# EAGLE schematic S140044_NOAA_TOWFISH (EAGLE 6.5.0)

## Sheet 1 of 5
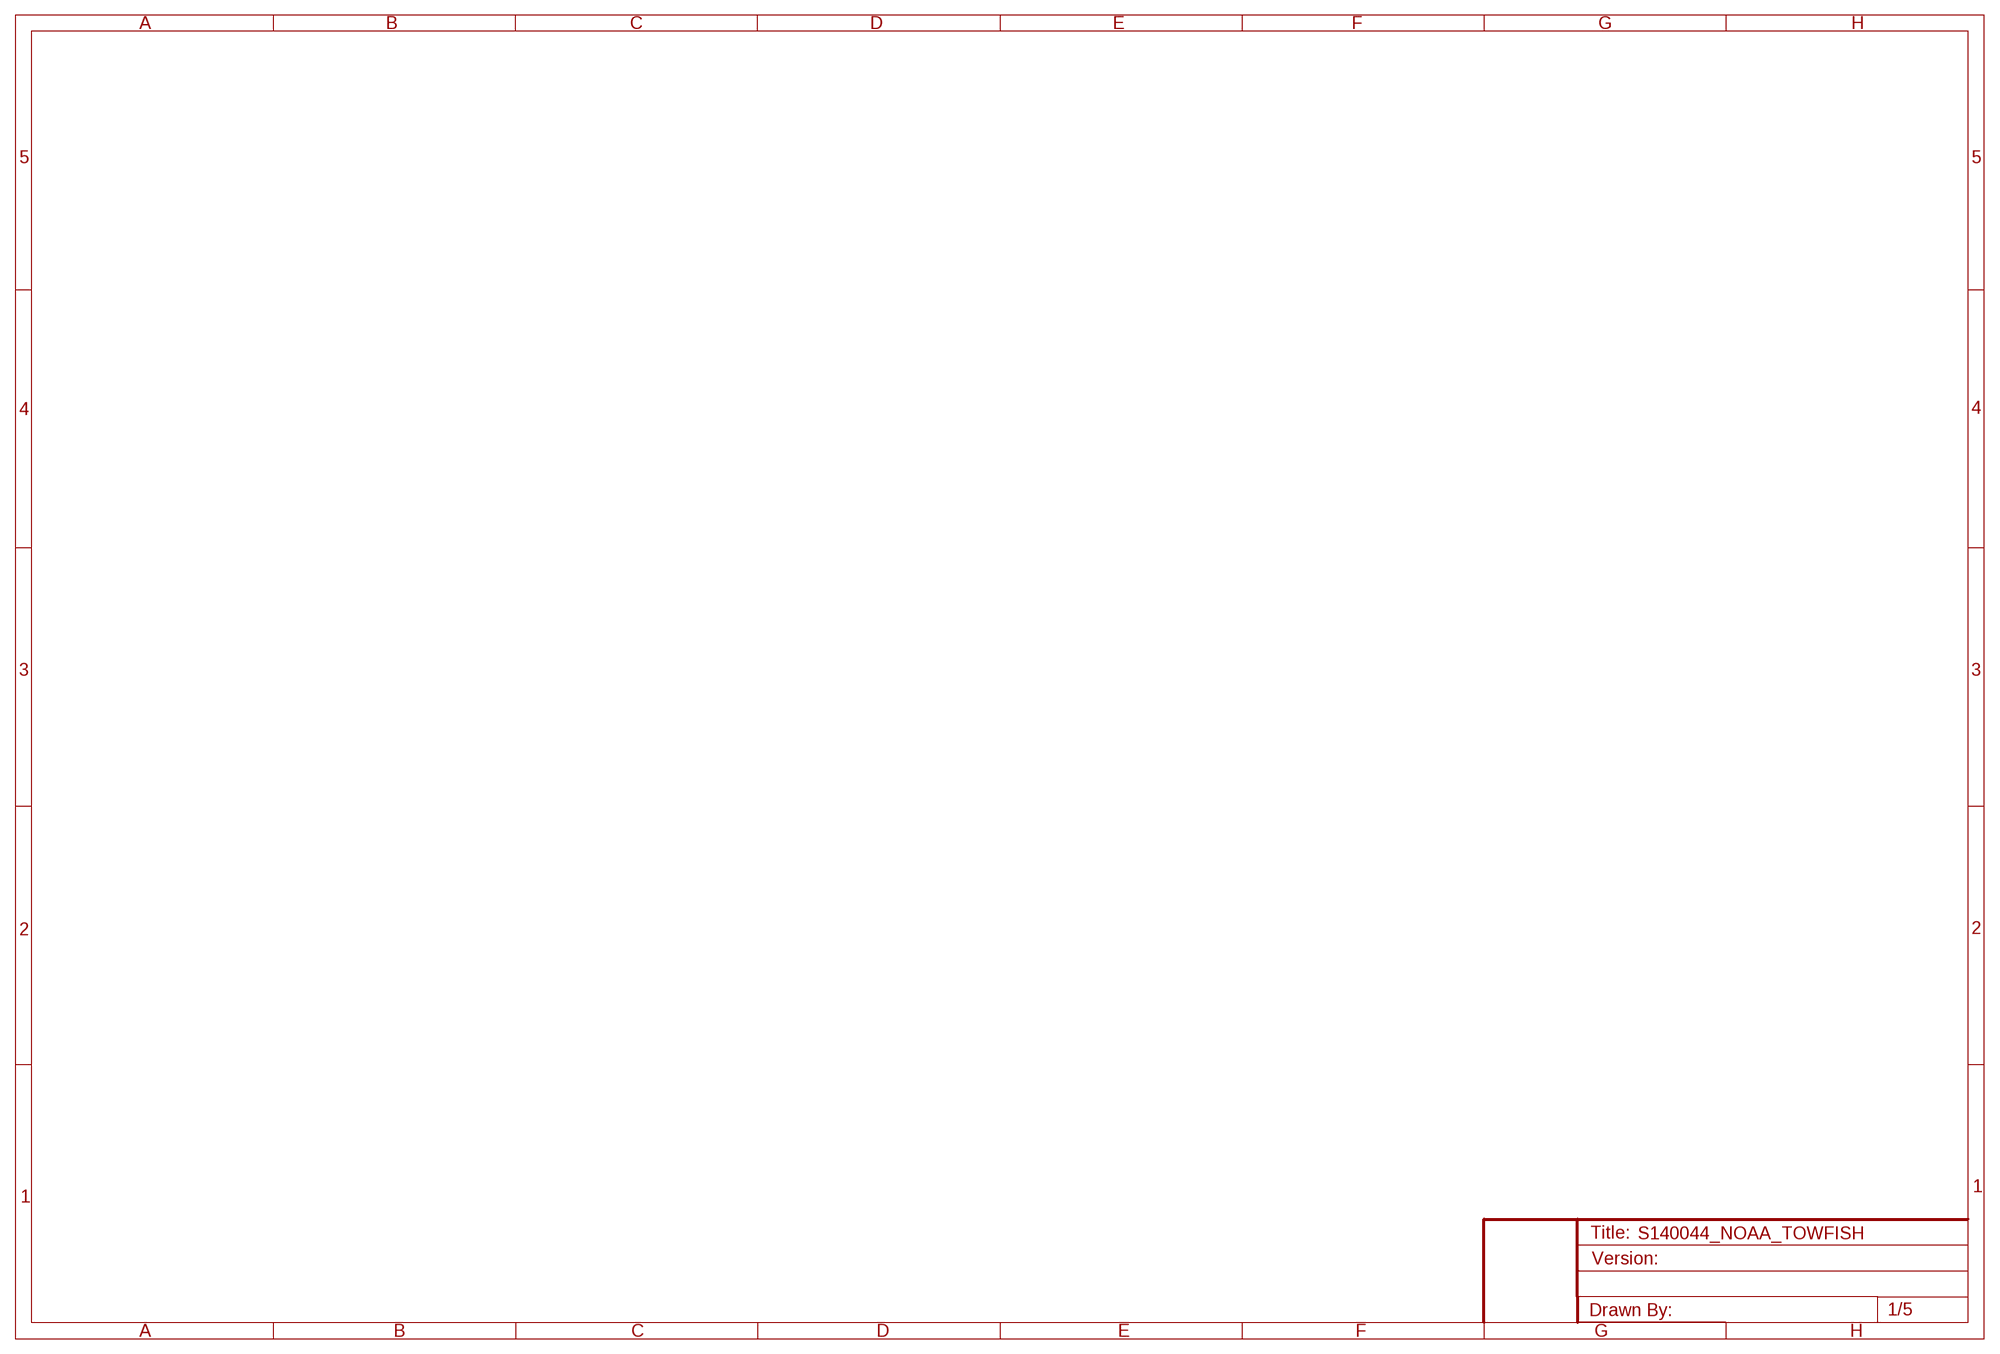
[diagram p0: schematic, sheet 1]

## Sheet 2 of 5
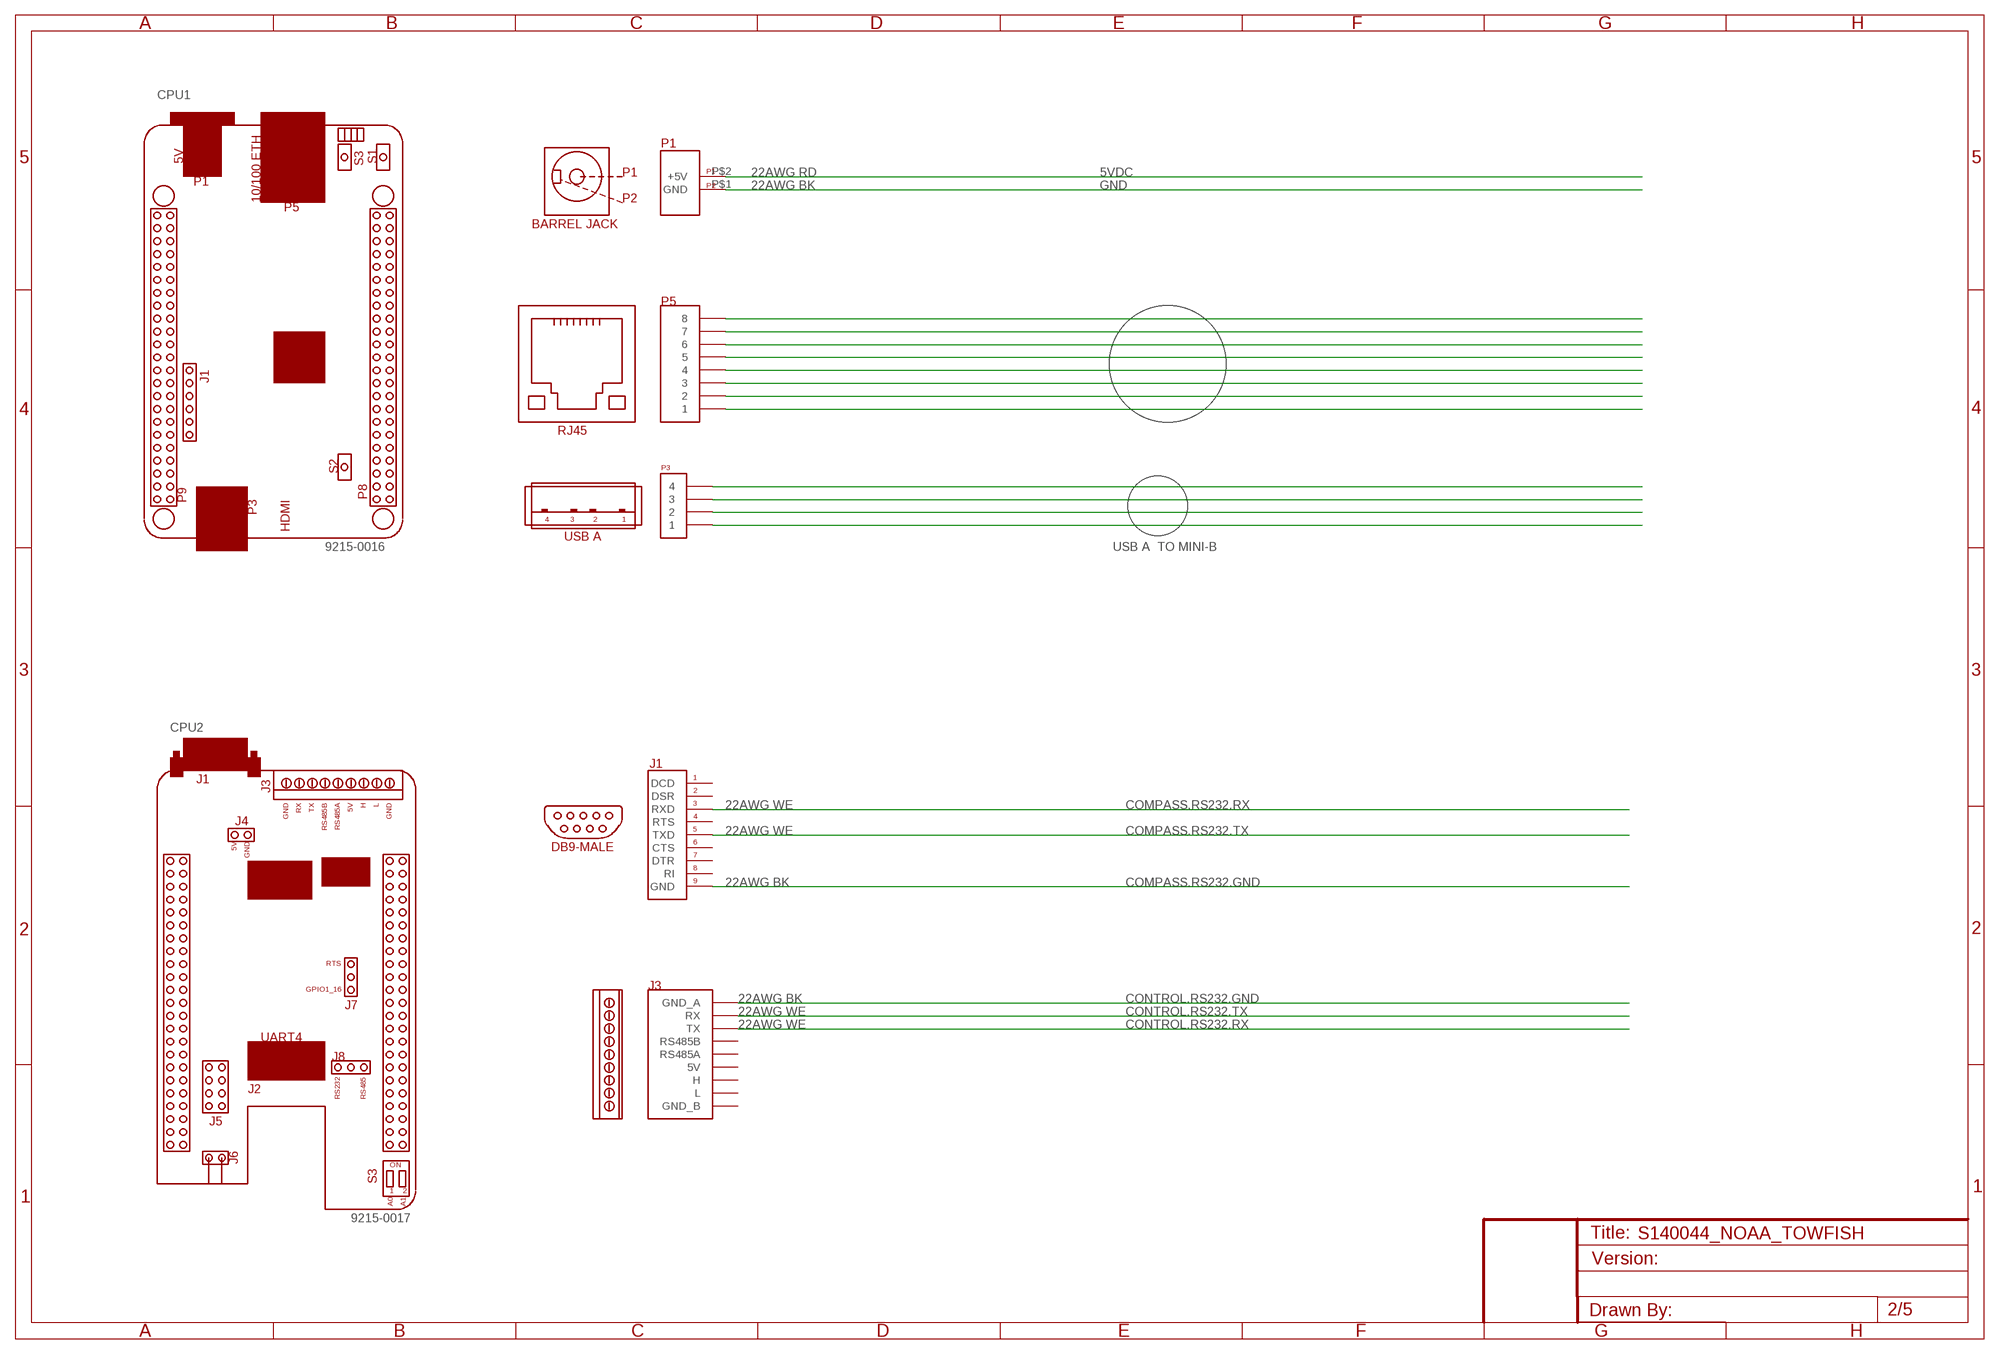
[diagram p1: schematic, sheet 2]

### Parts
U$3  BEAGLEBONE_BLACK_P1  [BOGUS]
U$4  BEAGLEBONE_BLACK_P3  [BOGUS]
U$5  BEAGLEBONE_SERIAL_J1  [BOGUS]
U$6  BEAGLEBONE_SERIAL_J3  [BOGUS]
U$7  BEAGLEBONE_BLACK_P5  [BOGUS]

### Nets
5VDC: U$3.P$2(+5V)
COMPASS.RS232.GND: U$5.P$5(GND) ; also sheet 4
COMPASS.RS232.RX: U$5.P$8(RXD) ; also sheet 4
COMPASS.RS232.TX: U$5.P$9(TXD) ; also sheet 4
CONTROL.RS232.GND: U$6.P$2(GND_A)
CONTROL.RS232.RX: U$6.P$9(TX)
CONTROL.RS232.TX: U$6.P$8(RX)
GND: U$3.P$1(GND)
N$3: U$7.P$8
N$4: U$7.P$7
N$5: U$7.P$6
N$6: U$7.P$5
N$7: U$7.P$4
N$8: U$7.P$3
N$9: U$7.P$2
N$10: U$7.P$1
N$11: U$4.P$4
N$12: U$4.P$3
N$13: U$4.P$2
N$14: U$4.P$1
Unconnected: U$5.P$1(CTS) U$5.P$2(DCD) U$5.P$3(DSR) U$5.P$4(DTR) U$5.P$6(RI) U$5.P$7(RTS) U$6.P$1(5V) U$6.P$3(GND_B) U$6.P$4(H) U$6.P$5(L) U$6.P$6(RS485A) U$6.P$7(RS485B)

### Notes on the sheet
- CPU1
- 22AWG RD
- 22AWG BK
- 9215-0016 | USB A  TO MINI-B
- CPU2
- 22AWG WE
- 22AWG WE
- 22AWG BK
- 22AWG BK
- 22AWG WE
- 22AWG WE
- 9215-0017

## Sheet 3 of 5
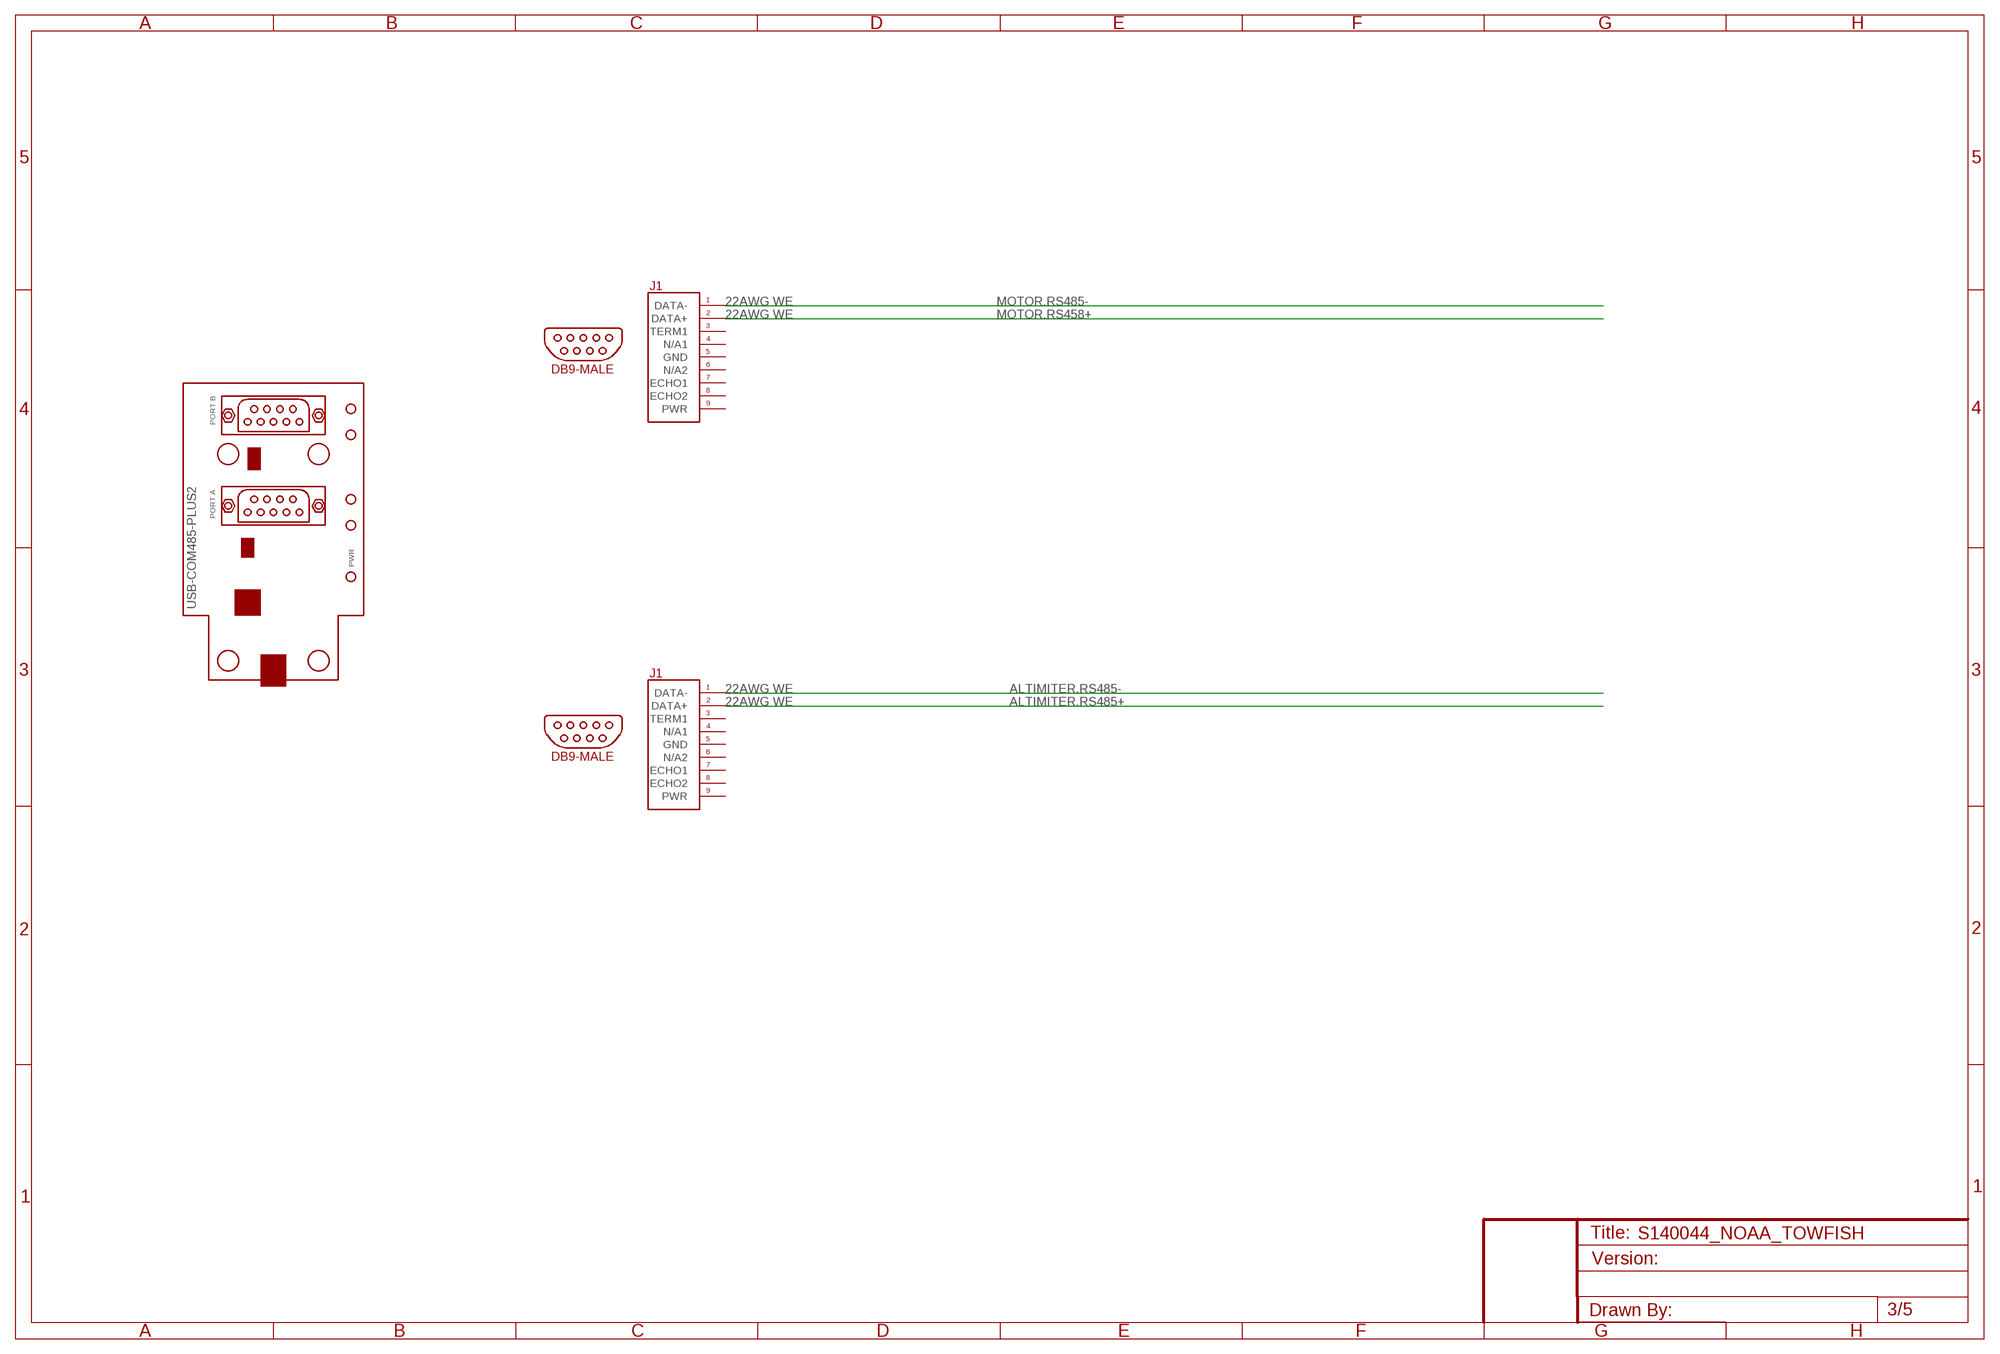
[diagram p2: schematic, sheet 3]

### Parts
U$10  FTDI_USB_RS485_COM2  [BOGUS]
U$11  FTDI_PORTB  [BOGUS]
U$12  FTDI_PORTA  [BOGUS]

### Nets
ALTIMITER.RS485+: U$12.P$1(DATA+)
ALTIMITER.RS485-: U$12.P$2(DATA-)
MOTOR.RS458+: U$11.P$1(DATA+)
MOTOR.RS485-: U$11.P$2(DATA-)
Unconnected: U$11.P$3(ECHO1) U$11.P$4(ECHO2) U$11.P$5(GND) U$11.P$6(N/A1) U$11.P$7(N/A2) U$11.P$8(PWR) U$11.P$9(TERM1) U$12.P$3(ECHO1) U$12.P$4(ECHO2) U$12.P$5(GND) U$12.P$6(N/A1) U$12.P$7(N/A2) U$12.P$8(PWR) U$12.P$9(TERM1)

### Notes on the sheet
- 22AWG WE
- 22AWG WE
- 22AWG WE
- 22AWG WE

## Sheet 4 of 5
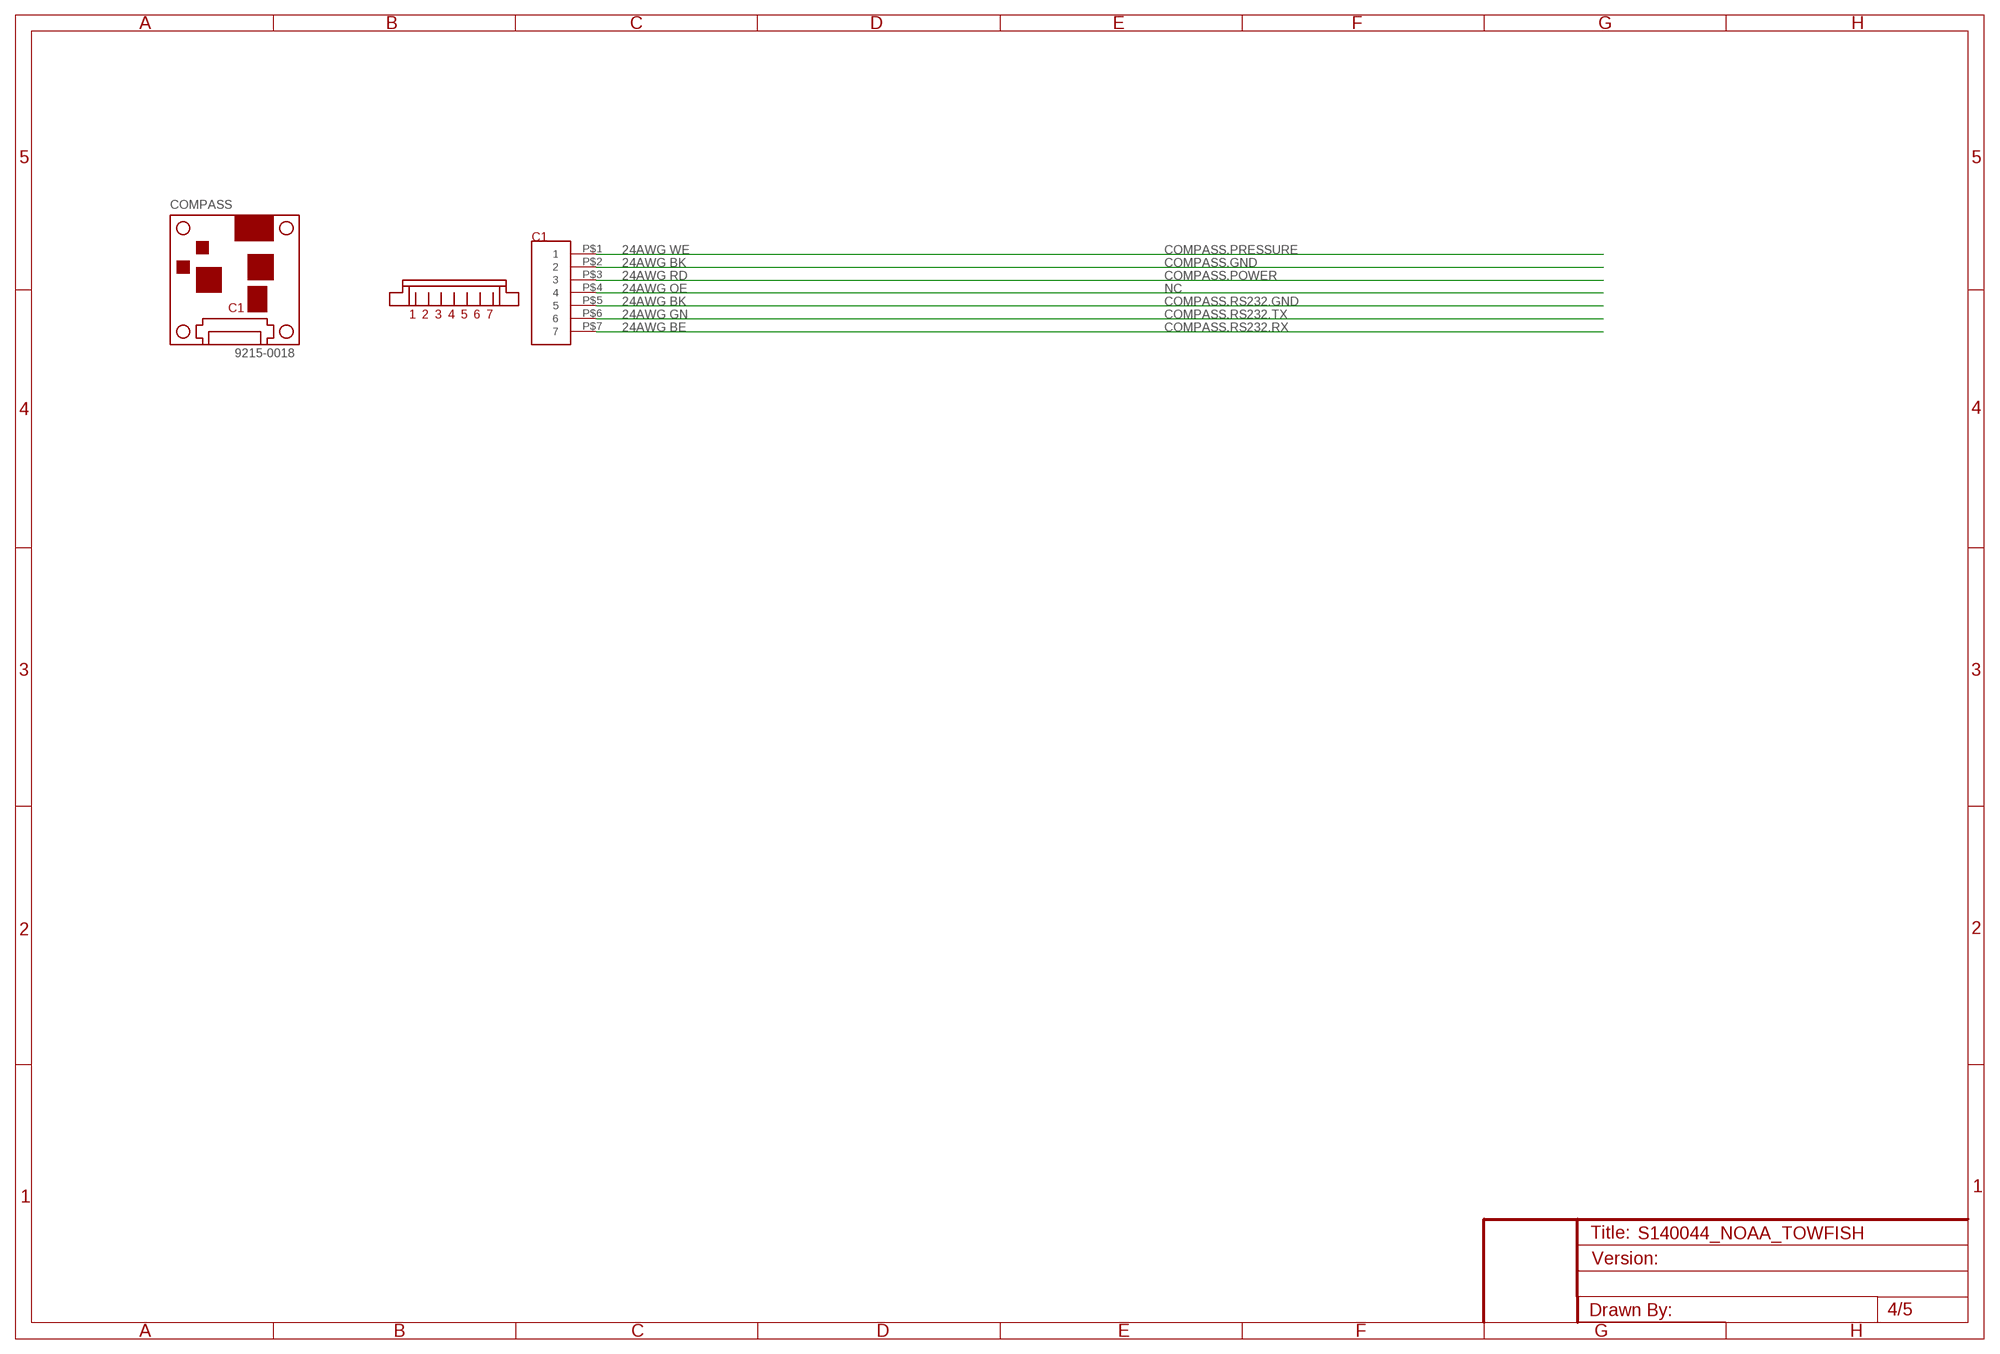
[diagram p3: schematic, sheet 4]

### Parts
U$8  OCEANSERVER_OS5000-S_C1  [BOGUS]

### Nets
COMPASS.GND: U$8.P$2
COMPASS.POWER: U$8.P$3
COMPASS.PRESSURE: U$8.P$1
COMPASS.RS232.GND: U$8.P$5 ; also sheet 2
COMPASS.RS232.RX: U$8.P$7 ; also sheet 2
COMPASS.RS232.TX: U$8.P$6 ; also sheet 2
NC: U$8.P$4

### Notes on the sheet
- COMPASS
- 24AWG WE
- 24AWG BK
- 24AWG RD
- 24AWG OE
- 24AWG BK
- 24AWG GN
- 24AWG BE
- 9215-0018

## Sheet 5 of 5
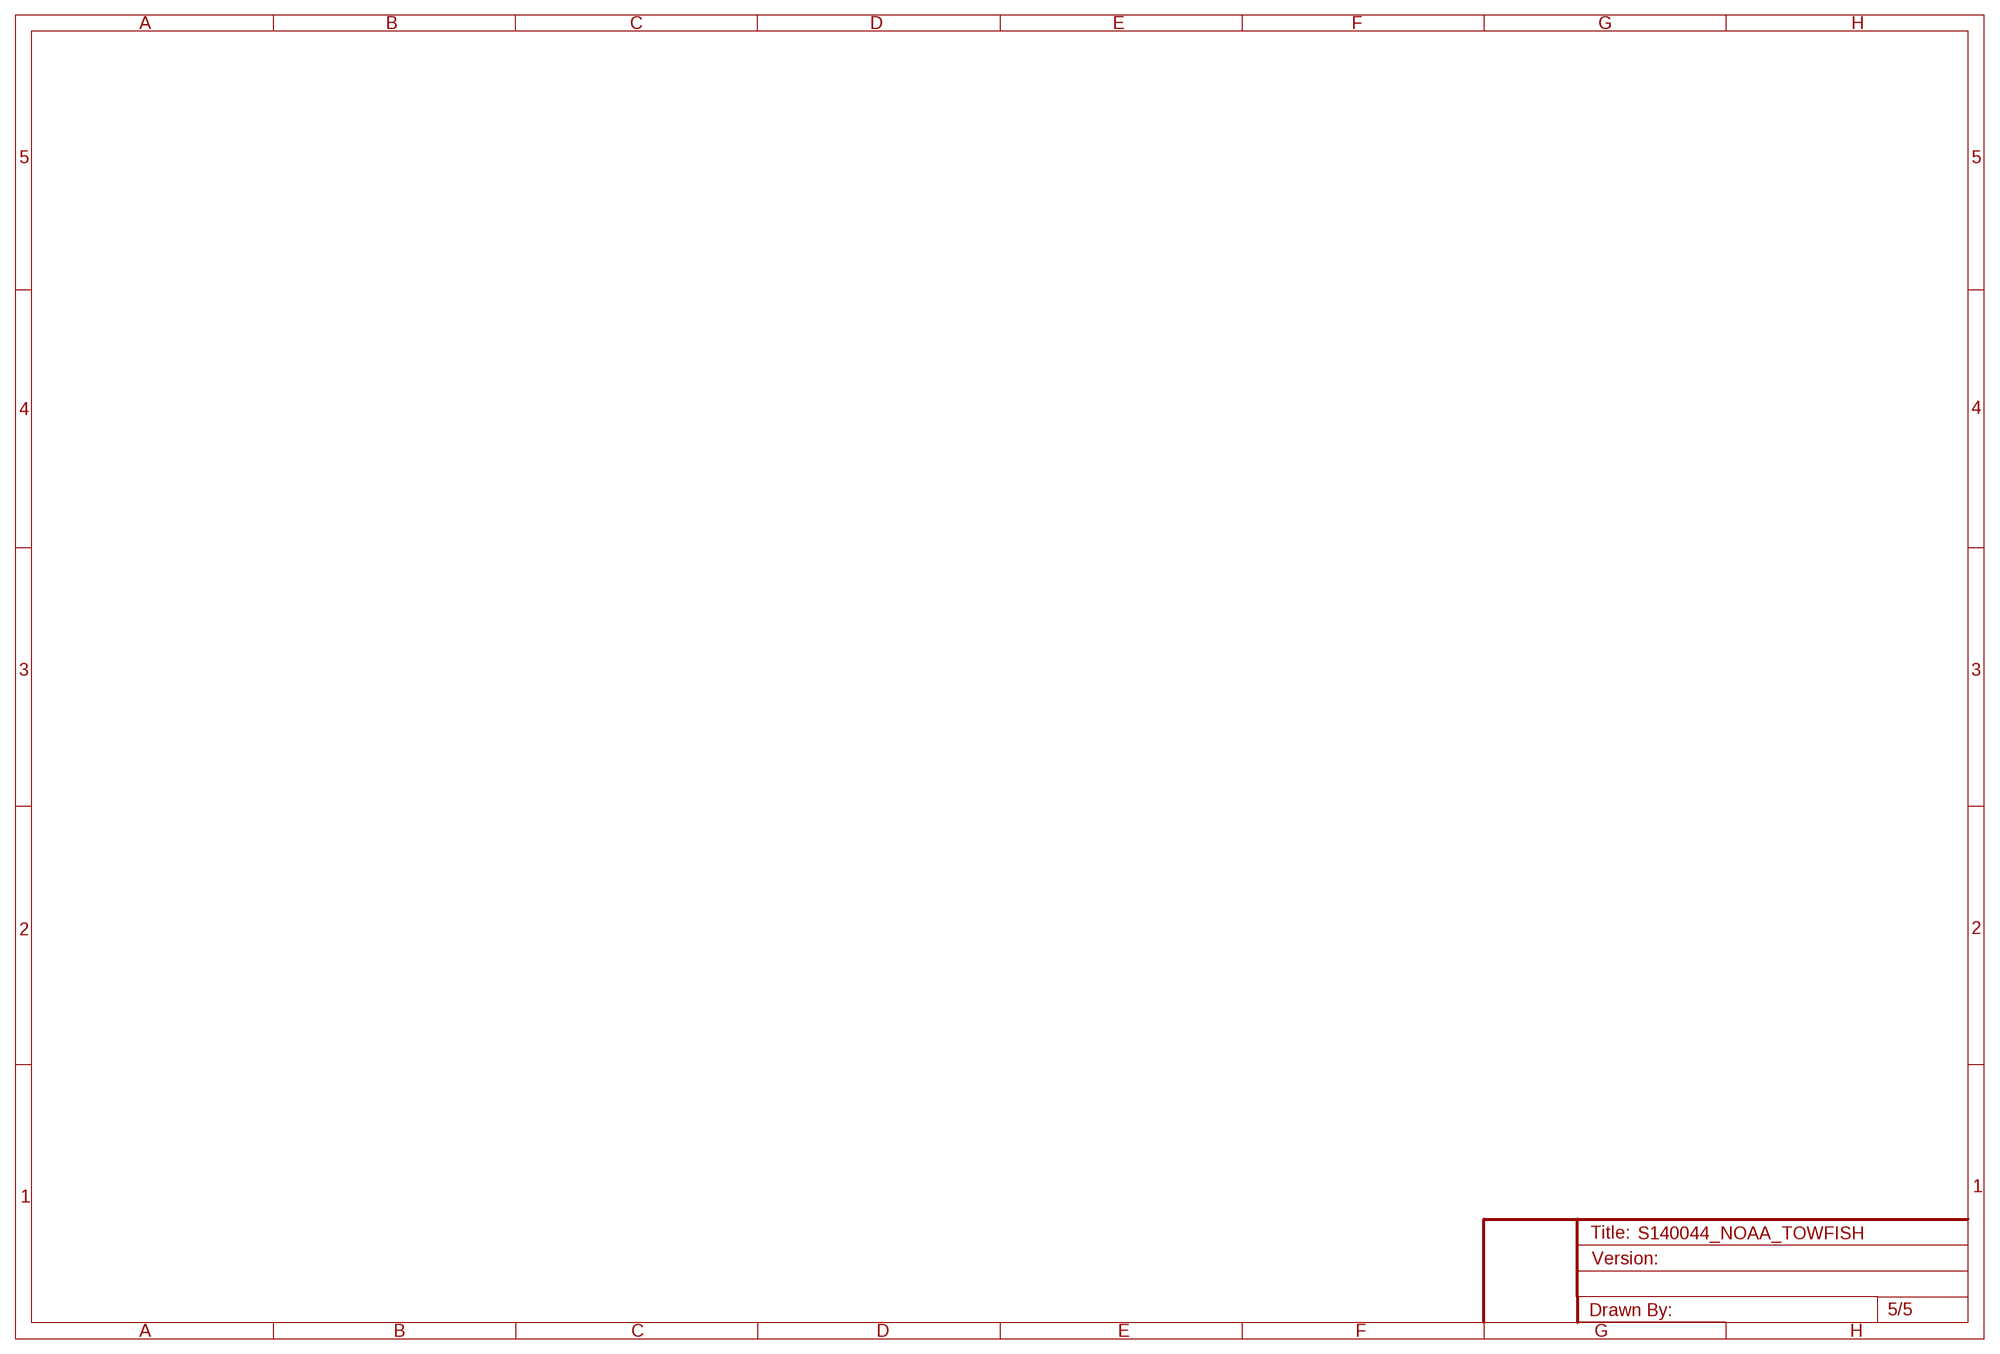
[diagram p4: schematic, sheet 5]

## Library data of the parts
U$3 = SOSI-Wiring-Diagram.rpt:BEAGLEBONE_BLACK_P1
U$4 = SOSI-Wiring-Diagram.rpt:BEAGLEBONE_BLACK_P3
U$5 = SOSI-Wiring-Diagram.rpt:BEAGLEBONE_SERIAL_J1
U$6 = SOSI-Wiring-Diagram.rpt:BEAGLEBONE_SERIAL_J3
U$7 = SOSI-Wiring-Diagram.rpt:BEAGLEBONE_BLACK_P5
U$8 = SOSI-Wiring-Diagram.rpt:OCEANSERVER_OS5000-S_C1
U$10 = SOSI-Wiring-Diagram.rpt:FTDI_USB_RS485_COM2
U$11 = SOSI-Wiring-Diagram.rpt:FTDI_PORTB
U$12 = SOSI-Wiring-Diagram.rpt:FTDI_PORTA